# EAGLE design PanelBoard (EAGLE 9.6.1)
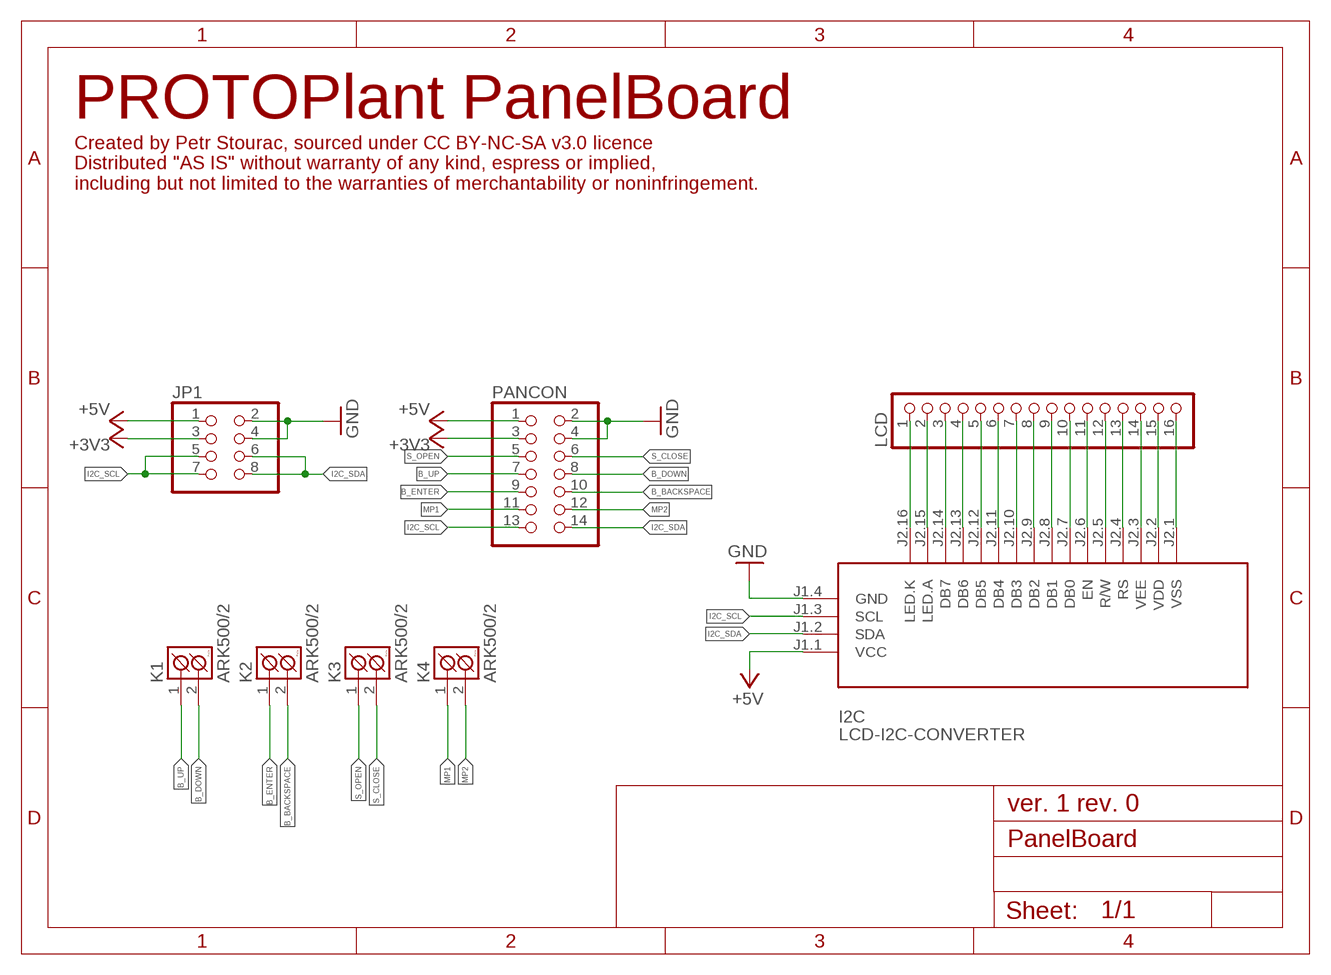
[diagram p0: schematic, sheet 1]

## Parts
I2C  LCD-I2C-CONVERTER  [LCD-I2C-CONVERTER]
JP1  PINHD-2X4/90  [2X04/90]
K1  ARK500/2  [ARK500/2]
K2  ARK500/2  [ARK500/2]
K3  ARK500/2  [ARK500/2]
K4  ARK500/2  [ARK500/2]
LCD  PINHD-1X16  [1X16]
PANCON  PINHD-2X7/90  [2X07/90]

## Nets
+3V3: JP1.3 PANCON.3
+5V: I2C.J1.1(VCC) JP1.1 PANCON.1
B_BACKSPACE: K2.2(K2) PANCON.10
B_DOWN: K1.2(K2) PANCON.8
B_ENTER: K2.1(K1) PANCON.9
B_UP: K1.1(K1) PANCON.7
GND: I2C.J1.4(GND) JP1.2 JP1.4 PANCON.2 PANCON.4
I2C_SCL: I2C.J1.3(SCL) JP1.5 JP1.7 PANCON.13
I2C_SDA: I2C.J1.2(SDA) JP1.6 JP1.8 PANCON.14
MP1: K4.1(K1) PANCON.11
MP2: K4.2(K2) PANCON.12
N$3: I2C.J2.16(LED.K) LCD.1
N$5: I2C.J2.15(LED.A) LCD.2
N$6: I2C.J2.14(DB7) LCD.3
N$7: I2C.J2.13(DB6) LCD.4
N$10: I2C.J2.12(DB5) LCD.5
N$11: I2C.J2.11(DB4) LCD.6
N$12: I2C.J2.10(DB3) LCD.7
N$13: I2C.J2.9(DB2) LCD.8
N$14: I2C.J2.8(DB1) LCD.9
N$15: I2C.J2.7(DB0) LCD.10
N$16: I2C.J2.6(EN) LCD.11
N$17: I2C.J2.5(R/W) LCD.12
N$18: I2C.J2.4(RS) LCD.13
N$19: I2C.J2.3(VEE) LCD.14
N$20: I2C.J2.2(VDD) LCD.15
N$21: I2C.J2.1(VSS) LCD.16
S_CLOSE: K3.2(K2) PANCON.6
S_OPEN: K3.1(K1) PANCON.5

## Notes on the sheet
- PROTOPlant PanelBoard
- Created by Petr Stourac, sourced under CC BY-NC-SA v3.0 licence
  Distributed "AS IS" without warranty of any kind, espress or implied, 
  including but not limited to the warranties of merchantability or noninfringement.
- ver. 1 rev. 0

## Library data of the parts
I2C = diy-modules:LCD-I2C-CONVERTER: I2C Bus to 4-Bit Parallel LCD Interface with LED backlight driver
JP1 = pinhead:PINHD-2X4: PIN HEADER
K1-K4 = #PaJa_konektory:ARK500/2: Svorkovnice - roztec 5mm - dvojita
LCD = pinhead:PINHD-1X16: PIN HEADER
PANCON = pinhead:PINHD-2X7: PIN HEADER

## Board
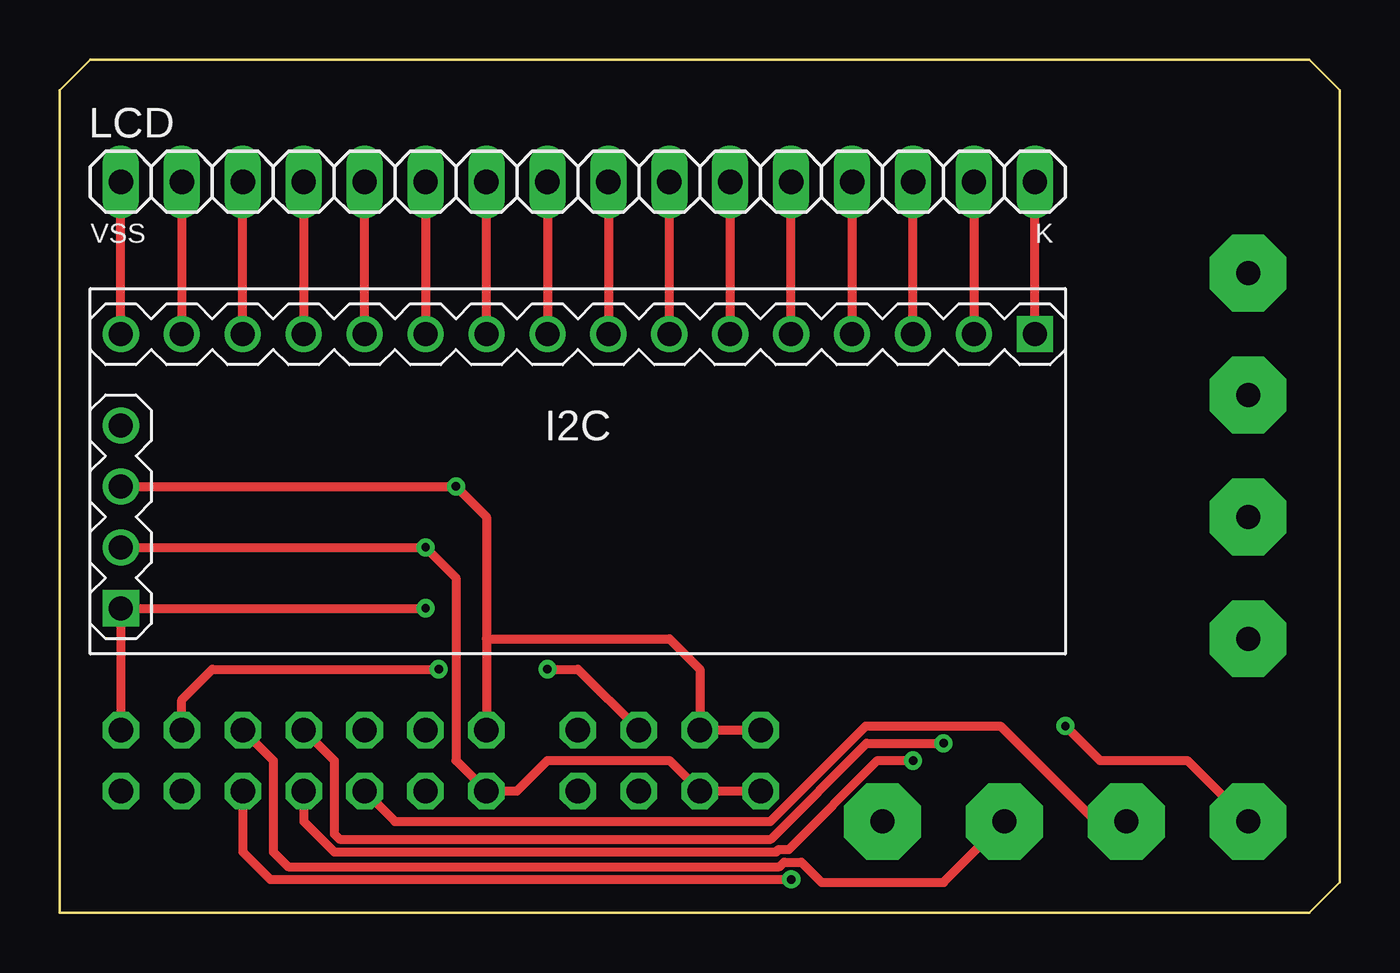
[diagram p1: board, top side]
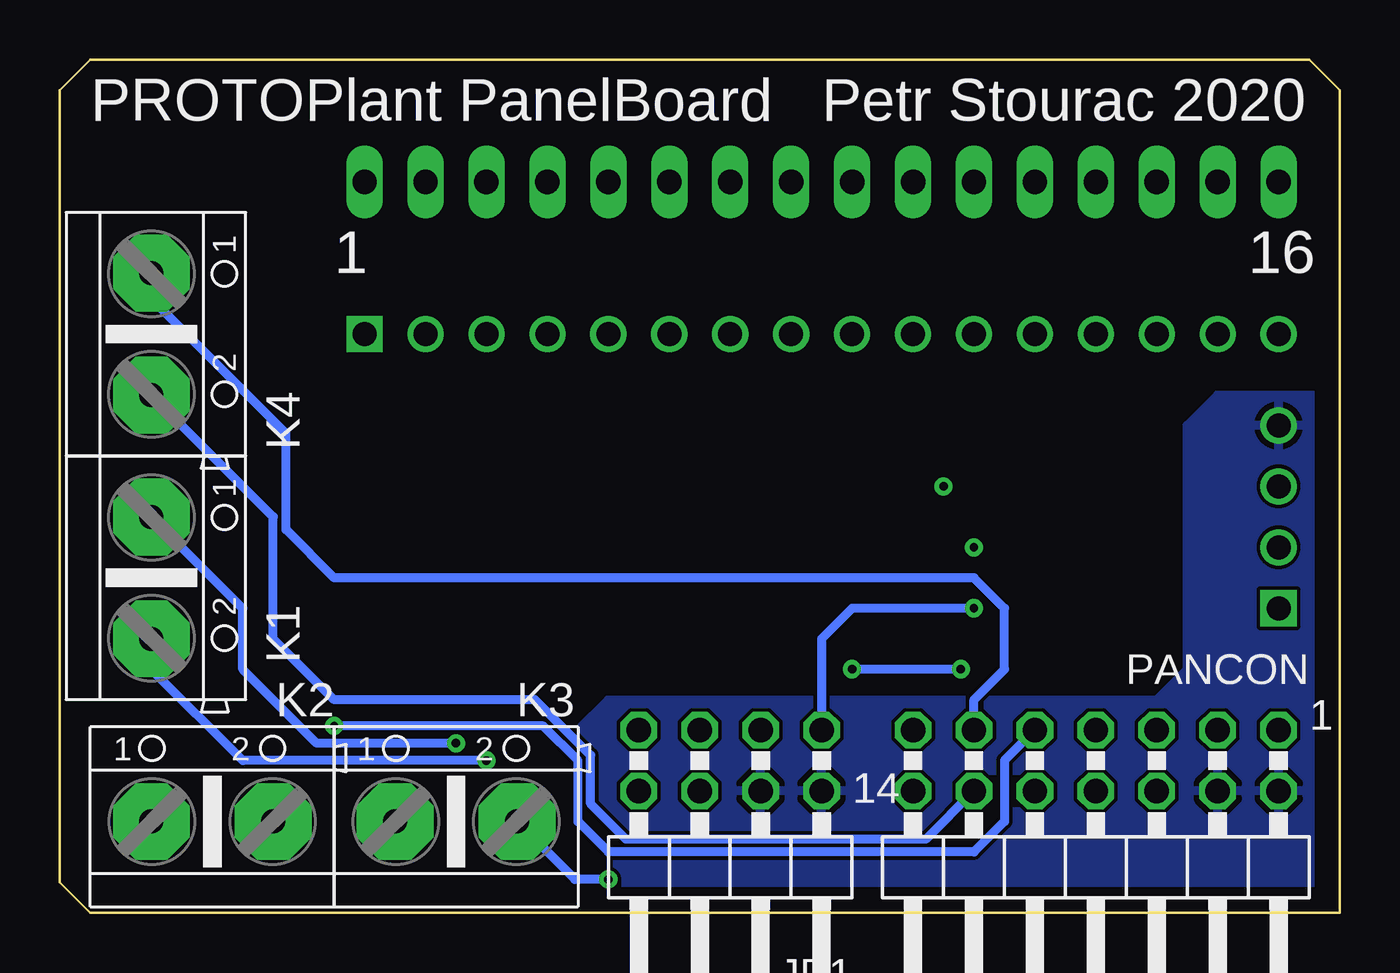
[diagram p2: board, bottom side, seen from below]

Size 53.34 x 35.56 mm. Coordinates in mm from the lower left corner, seen from the top.
Outline: 0,0 52.07,0 53.34,1.27 53.34,34.29 52.07,35.56 1.27,35.56 0,34.29 0,0
Copper layers (1*16): Top 0.035mm / dielectric 1.5mm / Bottom 0.035mm
Design rules "default *": minimum track width 15mil, minimum drill 0.35mm, track to track 6mil, track to pad 6mil, pad to pad 6mil, via to via 6mil, smd to smd 6mil, copper to edge 40mil, drill to drill 6mil, minimum pad ring 10mil, minimum via ring 8mil, stop-mask expansion 4mil, vias tented up to drill 0mil, thermal gap 10mil

### Footprints (pad centres in the part's own frame; a part is rotated, then mirrored left to right if it is on the bottom)
LCD-I2C-CONVERTER = drill 1 square: J1.1 -19.05,-5.08; J2.1 19.05,6.35 | drill 1: J1.2 -19.05,-2.54; J1.3 -19.05,0; J1.4 -19.05,2.54; J2.2 16.51,6.35; J2.3 13.97,6.35; J2.4 11.43,6.35; J2.5 8.89,6.35; J2.6 6.35,6.35; J2.7 3.81,6.35; J2.8 1.27,6.35; J2.9 -1.27,6.35; J2.10 -3.81,6.35; J2.11 -6.35,6.35; J2.12 -8.89,6.35; J2.13 -11.43,6.35; J2.14 -13.97,6.35; J2.15 -16.51,6.35; J2.16 -19.05,6.35
2X04/90 = drill 1.016 octagon: 1 -3.81,-6.35; 2 -3.81,-3.81; 3 -1.27,-6.35; 4 -1.27,-3.81; 5 1.27,-6.35; 6 1.27,-3.81; 7 3.81,-6.35; 8 3.81,-3.81
ARK500/2 = drill 1 pad 3.2 octagon: 1 -2.54,0; 2 2.54,0
1X16 = drill 1.016 long: 1 -19.05,0; 2 -16.51,0; 3 -13.97,0; 4 -11.43,0; 5 -8.89,0; 6 -6.35,0; 7 -3.81,0; 8 -1.27,0; 9 1.27,0; 10 3.81,0; 11 6.35,0; 12 8.89,0; 13 11.43,0; 14 13.97,0; 15 16.51,0; 16 19.05,0
2X07/90 = drill 1.016 octagon: 1 -7.62,-6.35; 2 -7.62,-3.81; 3 -5.08,-6.35; 4 -5.08,-3.81; 5 -2.54,-6.35; 6 -2.54,-3.81; 7 0,-6.35; 8 0,-3.81; 9 2.54,-6.35; 10 2.54,-3.81; 11 5.08,-6.35; 12 5.08,-3.81; 13 7.62,-6.35; 14 7.62,-3.81

### Placement (x,y rotation side)
I2C  21.59,17.78 0 top
JP1  25.4,1.27 180 bottom
K1  49.53,13.97 270 bottom
K2  46.99,3.81 0 bottom
K3  36.83,3.81 0 bottom
K4  49.53,24.13 270 bottom
LCD  21.59,30.48 0 top
PANCON  10.16,1.27 180 bottom

### Tracks (layer width: path | path; a pad name or v marks a point on that pad's centre or on a via)
+3V3  (via drill 0.35)
  Top 0.381: PANCON.3 5.08,8.89 6.35,10.16 v15.79,10.16 | v20.32,10.16 21.59,10.16 JP1.3
  Bottom 0.381: v15.79,10.16 v20.32,10.16
+5V  (via drill 0.35)
  Top 0.381: PANCON.1 I2C.J1.1 v15.24,12.7
  Bottom 0.381: v15.24,12.7 20.32,12.7 21.59,11.43 JP1.1
B_BACKSPACE
  Top 0.381: PANCON.10 13.97,3.81 29.61,3.81 33.59,7.79 39.2,7.79 43.18,3.81 K2.2
B_DOWN  (via drill 0.35)
  Top 0.381: PANCON.8 10.16,3.81 11.43,2.54 29.85,2.54 29.96,2.65 30.38,2.65 34.08,6.35 v35.56,6.35
  Bottom 0.381: v35.56,6.35 45.72,6.35 49.53,10.16 K1.2
B_ENTER  (via drill 0.35)
  Top 0.381: v41.91,7.79 43.35,6.35 46.99,6.35 K2.1
  Bottom 0.381: PANCON.9 13.97,6.35 13.97,3.81 15.24,2.54 30.48,2.54 31.75,3.81 31.75,6.35 33.19,7.79 v41.91,7.79
B_UP  (via drill 0.35)
  Top 0.381: PANCON.7 11.43,6.35 11.43,3.29 11.65,3.07 29.63,3.07 33.63,7.07 v36.83,7.07
  Bottom 0.381: v36.83,7.07 42.63,7.07 45.72,10.16 45.72,12.7 K1.1
GND
  pour Bottom: 2.54,21.59 1.27,21.59 0,21.59 -1.27,20.32 -1.27,-1.27 31.75,-1.27 31.75,7.62 30.48,8.89 7.62,8.89 6.35,10.16 6.35,20.32 5.08,21.59
I2C_SCL  (via drill 0.35)
  Top 0.381: 17.78,11.43 17.78,16.51 v16.51,17.78 I2C.J1.3 | 17.78,11.43 PANCON.13 | 17.78,11.43 25.4,11.43 26.67,10.16 JP1.5 JP1.7
I2C_SDA  (via drill 0.35)
  Top 0.381: I2C.J1.2 v15.24,15.24 16.51,13.97 16.51,6.35 PANCON.14 19.05,5.08 20.32,6.35 25.4,6.35 JP1.6 JP1.8
MP1
  Bottom 0.381: PANCON.11 15.24,8.89 13.97,10.16 13.97,12.7 15.24,13.97 41.91,13.97 43.92,15.98 43.92,19.99 49.53,25.61 K4.1
MP2
  Bottom 0.381: PANCON.12 17.25,3.07 29.74,3.07 31.22,4.55 31.22,6.57 33.54,8.89 41.91,8.89 44.45,11.43 44.45,16.51 K4.2
N$3
  Top 0.381: I2C.J2.16 LCD.1
N$5
  Top 0.381: LCD.2 I2C.J2.15
N$6
  Top 0.381: I2C.J2.14 LCD.3
N$7
  Top 0.381: LCD.4 I2C.J2.13
N$10
  Top 0.381: I2C.J2.12 LCD.5
N$11
  Top 0.381: LCD.6 I2C.J2.11
N$12
  Top 0.381: I2C.J2.10 LCD.7
N$13
  Top 0.381: LCD.8 I2C.J2.9
N$14
  Top 0.381: LCD.9 I2C.J2.8
N$15
  Top 0.381: I2C.J2.7 LCD.10
N$16
  Top 0.381: LCD.11 I2C.J2.6
N$17
  Top 0.381: I2C.J2.5 LCD.12
N$18
  Top 0.381: LCD.13 I2C.J2.4
N$19
  Top 0.381: I2C.J2.3 LCD.14
N$20
  Top 0.381: LCD.15 I2C.J2.2
N$21
  Top 0.381: I2C.J2.1 LCD.16
S_CLOSE  (via drill 0.35)
  Top 0.381: PANCON.6 7.62,2.54 8.77,1.39 v30.48,1.39
  Bottom 0.381: v30.48,1.39 31.87,1.39 K3.2
S_OPEN
  Top 0.381: PANCON.5 8.89,6.35 8.89,2.54 9.5,1.93 29.99,1.93 30.18,2.12 30.91,2.12 31.75,1.27 36.83,1.27 K3.1

### Text on the board
tNames: VSS | K
bNames: Petr Stourac 2020 | PROTOPlant PanelBoard | 16 | 1 | 1 | 14